# EAGLE design jarpysdr (EAGLE 6.1)
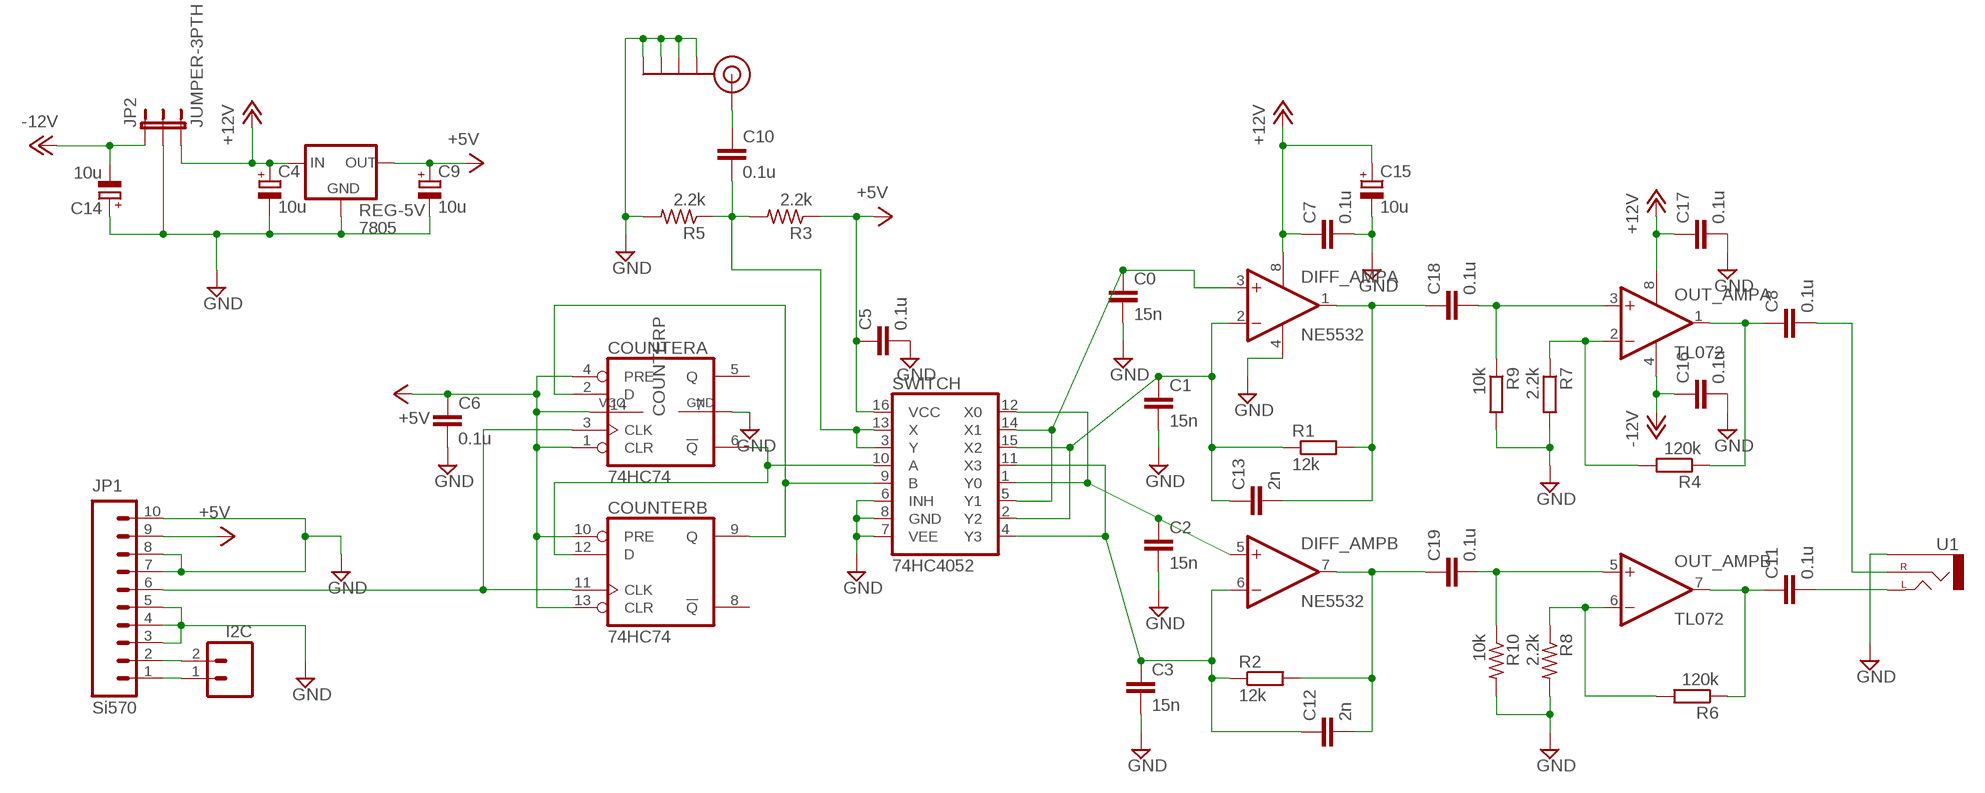
[diagram p0: schematic, sheet 1]

## Parts
ANTENNA  SMA_EDGE  [SMA-EDGE]
C0  15n  C-EU025-024X044  [C025-024X044]
C1  15n  C-EU025-024X044  [C025-024X044]
C2  15n  C-EU025-024X044  [C025-024X044]
C3  15n  C-EU025-024X044  [C025-024X044]
C4  10u  CPOL-EUE2.5-6  [E2,5-6]
C5  0.1u  C-EU025-025X050  [C025-025X050]
C6  0.1u  C-EU025-025X050  [C025-025X050]
C7  0.1u  C-EU025-025X050  [C025-025X050]
C8  0.1u  C-EU050-025X075  [C050-025X075]
C9  10u  CPOL-EUE2.5-6  [E2,5-6]
C10  0.1u  C-EU025-024X044  [C025-024X044]
C11  0.1u  C-EU050-025X075  [C050-025X075]
C12  2n  C-EU025-024X044  [C025-024X044]
C13  2n  C-EU025-024X044  [C025-024X044]
C14  10u  CPOL-EUE2.5-6  [E2,5-6]
C15  10u  CPOL-EUE2.5-6  [E2,5-6]
C16  0.1u  C-EU025-025X050  [C025-025X050]
C17  0.1u  C-EU025-025X050  [C025-025X050]
C18  0.1u  C-EU050-025X075  [C050-025X075]
C19  0.1u  C-EU050-025X075  [C050-025X075]
COUNTER  74HC74  74HC74N  [DIL14]
DIFF_AMP  NE5532  NE5532N  [DIL08]
I2C  M02PTH  [1X02]
JP1  Si570  M10"  [1X10]
JP2  JUMPER-3PTH  [1X03]
OUT_AMP  TL072  TL072P  [DIL08]
R1  12k  R-EU_0204/7  [0204/7]
R2  12k  R-EU_0204/7  [0204/7]
R3  2.2k  R-US_0204/7  [0204/7]
R4  120k  R-EU_0204/7  [0204/7]
R5  2.2k  R-US_0204/7  [0204/7]
R6  120k  R-EU_0204/7  [0204/7]
R7  2.2k  R-EU_0204/7  [0204/7]
R8  2.2k  R-US_0204/7  [0204/7]
R9  10k  R-EU_0204/7  [0204/7]
R10  10k  R-US_0204/7  [0204/7]
REG-5V  7805  78XXS  [78XXS]
SWITCH  74HC4052  74HC4052DIP  [DIL16]
U1  AUDIO-JACKPTH  [AUDIO-JACK]

## Nets
+5V: C5.1 C6.1 C9.+ COUNTER.1(A:CLR) COUNTER.4(A:PRE) COUNTER.10(B:PRE) COUNTER.13(B:CLR) COUNTER.14(P:VCC) JP1.9 R3.1 REG-5V.OUT SWITCH.16(VCC)
+12V: C4.+ C7.1 C15.+ C17.1 DIFF_AMP.8(P:V+) JP2.3 OUT_AMP.8(P:V+) REG-5V.IN
-12V: C14.- C16.1 JP2.1 OUT_AMP.4(P:V-)
C-180DEG: C1.1 C13.1 DIFF_AMP.2(A:-IN) R1.1 SWITCH.2(Y2) SWITCH.15(X2)
CLK: COUNTER.3(A:CLK) COUNTER.11(B:CLK) JP1.6
GND: ANTENNA.GND@0(GND) ANTENNA.GND@1(GND) ANTENNA.GND@2(GND) ANTENNA.GND@3(GND) C0.2 C1.2 C2.2 C3.2 C4.- C5.2 C6.2 C7.2 C9.- C14.+ C15.- C16.2 C17.2 COUNTER.7(P:GND) DIFF_AMP.4(P:V-) JP1.3 JP1.4 JP1.5 JP1.7 JP1.8 JP1.10 JP2.2 R5.2 R7.2 R8.2 R9.2 R10.2 REG-5V.GND SWITCH.6(INH) SWITCH.7(VEE) SWITCH.8(GND) U1.SLEEVE
N$1: C2.1 DIFF_AMP.5(B:+IN) SWITCH.1(Y0) SWITCH.12(X0)
N$2: COUNTER.2(A:D) COUNTER.9(B:Q) SWITCH.9(B)
N$3: COUNTER.6(A:!Q) COUNTER.12(B:D) SWITCH.10(A)
N$4: C10.2 R3.2 R5.1 SWITCH.3(Y) SWITCH.13(X)
N$5: C0.1 DIFF_AMP.3(A:+IN) SWITCH.5(Y1) SWITCH.14(X1)
N$6: C13.2 C18.1 DIFF_AMP.1(A:OUT) R1.2
N$7: ANTENNA.SIG(SIGNAL) C10.1
N$8: C11.2 U1.TIP(LEFT)
N$9: C8.2 U1.RING(RIGHT)
N$10: C12.2 C19.1 DIFF_AMP.7(B:OUT) R2.2
N$11: C8.1 OUT_AMP.1(A:OUT) R4.1
N$12: OUT_AMP.2(A:-IN) R4.2 R7.1
N$13: C11.1 OUT_AMP.7(B:OUT) R6.1
N$14: C3.1 C12.1 DIFF_AMP.6(B:-IN) R2.1 SWITCH.4(Y3) SWITCH.11(X3)
N$15: OUT_AMP.6(B:-IN) R6.2 R8.1
N$16: I2C.1 JP1.1
N$17: I2C.2 JP1.2
N$18: C18.2 OUT_AMP.3(A:+IN) R9.1
N$19: C19.2 OUT_AMP.5(B:+IN) R10.1
Unconnected: COUNTER.5(A:Q) COUNTER.8(B:!Q)

## Library data of the parts
ANTENNA = SparkFun:SMA_EDGE: SMA Antenna Connector End launch SMA connector. The paste layer has been removed so that the connector can be hand soldered onto the board after reflow.
C0 C1-C3 C5-C8 C10-C13 C16-C19 = resistor:C-EU: CAPACITOR, European symbol
C4 C9 C14 C15 = resistor:CPOL-EU: POLARIZED CAPACITOR, European symbol
COUNTER = jarpy:74*74: Dual D type positive edge triggered FLIP FLOP, preset and clear
DIFF_AMP = linear:NE5532: AUDIO AMPLIFIER
I2C = SparkFun:M02: Header 2 Standard 2-pin 0.1" header. Use with straight break away headers (SKU : PRT-00116), right angle break away headers (PRT-00553), swiss pins (PRT-00743), machine pins (PRT-00117), and female headers (PRT-00115). Molex polarized connector foot print use with SKU : PRT-08233 with associated crimp pins and housings.
JP1 = SparkFun:M10: Header 10 Standard 10-pin 0.1" header. Use with straight break away headers (SKU : PRT-00116), right angle break away headers (PRT-00553), swiss pins (PRT-00743), machine pins (PRT-00117), and female headers (PRT-00115).
JP2 = SparkFun:JUMPER-3
OUT_AMP = linear:TL072: OP AMP
R1 R2 R4 R6 R7 R9 = resistor:R-EU_: RESISTOR, European symbol
R3 R5 R8 R10 = resistor:R-US_: RESISTOR, American symbol
REG-5V = v-reg:78XXS: VOLTAGE REGULATOR
SWITCH = SparkFun:74HC4052
U1 = SparkFun:AUDIO-JACK: 3.5mm Audio Jack Simple 3.5mm common PCB mount audio jack. SKU: PRT-08032

## Board
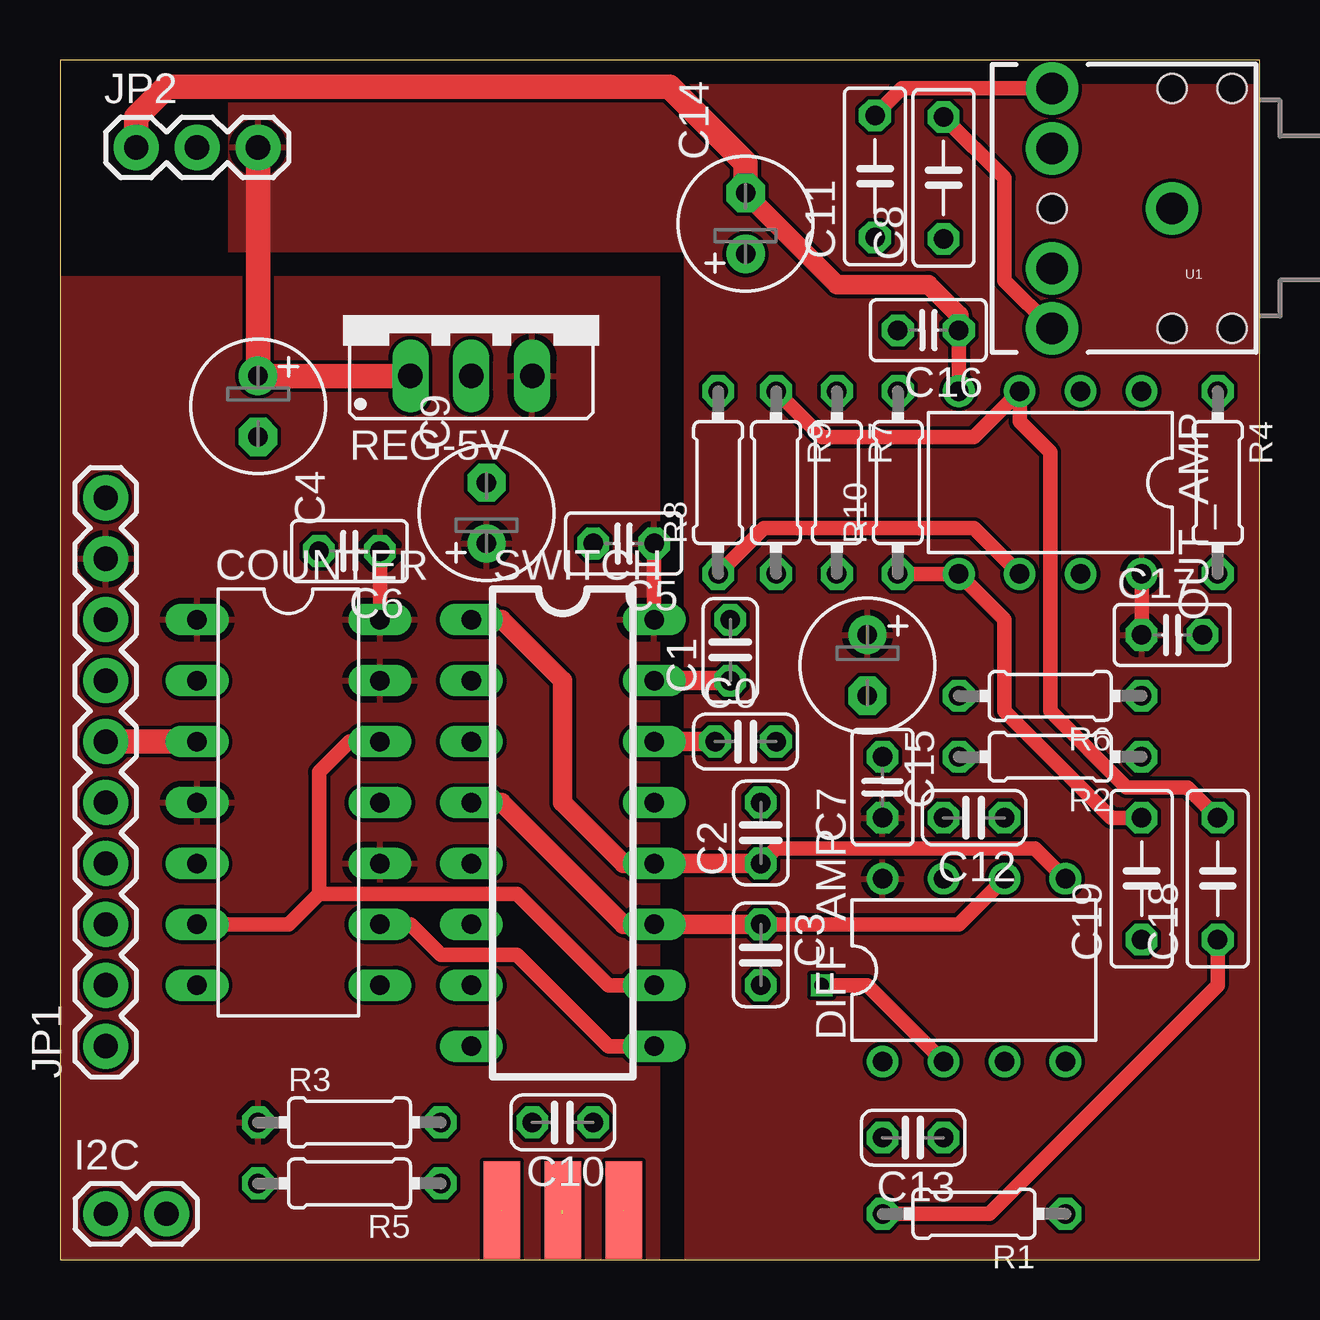
[diagram p1: board, top side]
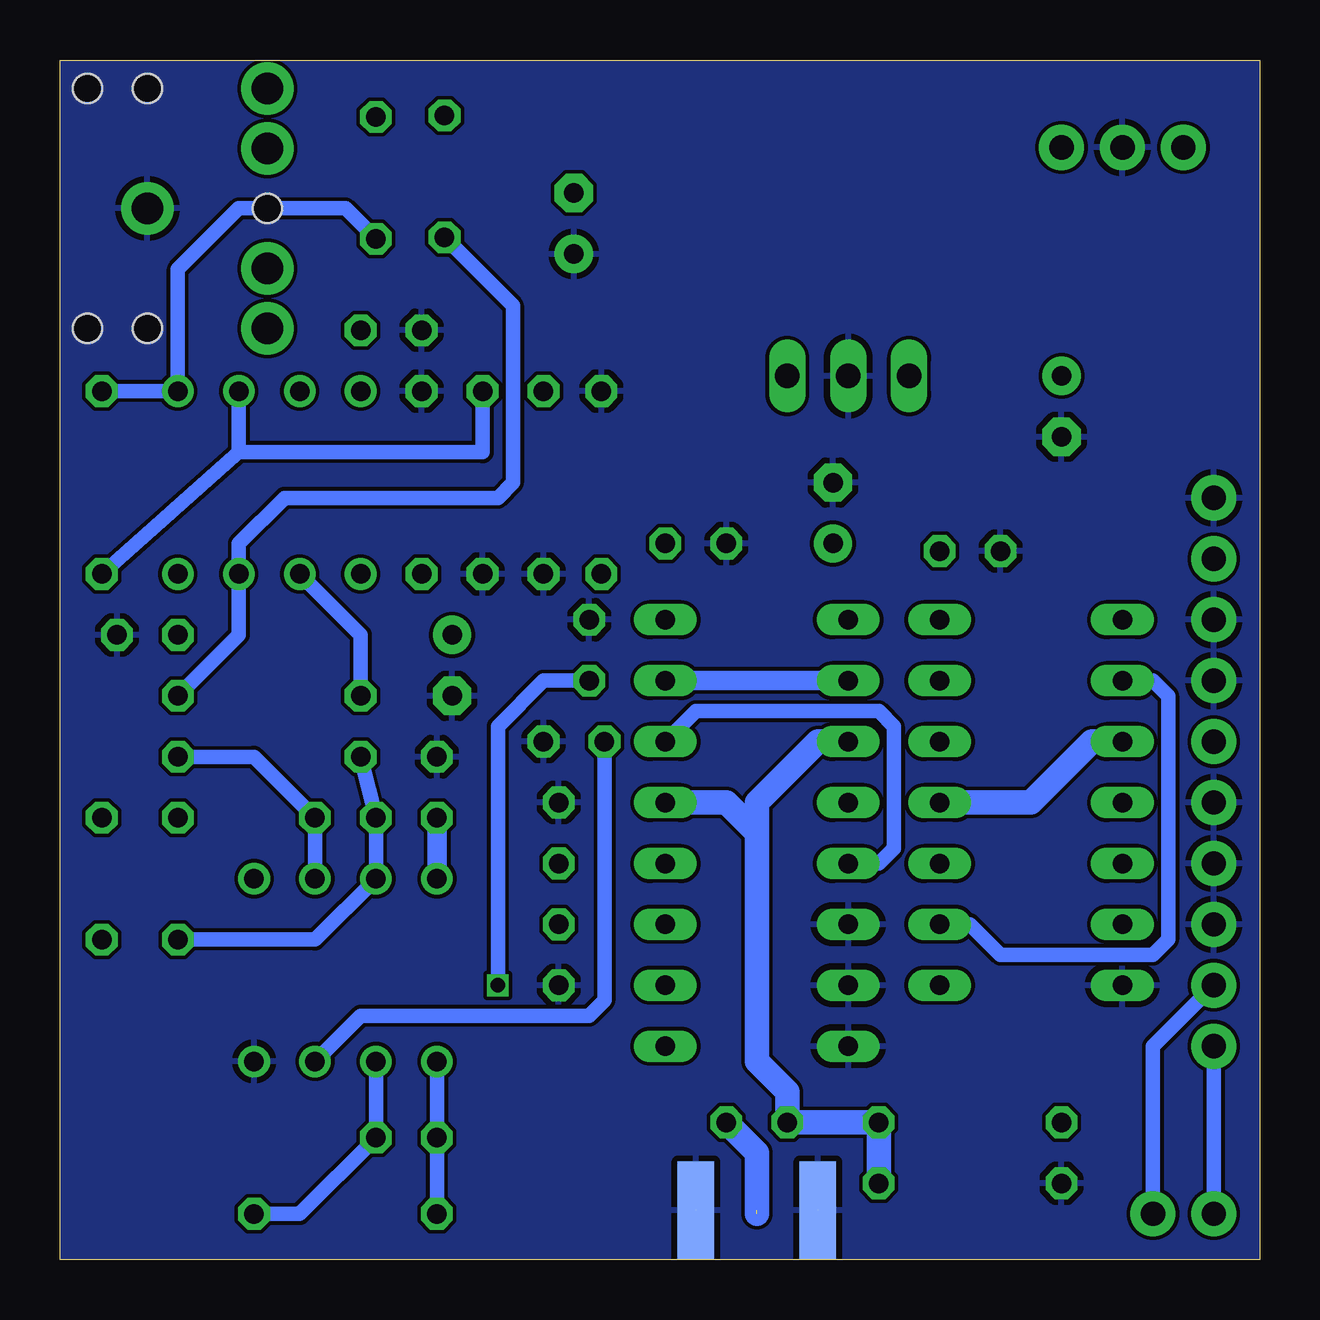
[diagram p2: board, bottom side, seen from below]

Size 50 x 50 mm. Coordinates in mm from the lower left corner, seen from the top.
Outline: 0,0 50,0 50,50 0,50 0,0
Copper layers (1*16): Top 0.035mm / dielectric 1.5mm / Bottom 0.035mm
Design rules: minimum track width 6mil, minimum drill 12mil, track to track 6mil, track to pad 6mil, pad to pad 6mil, via to via 6mil, smd to smd 0mil, copper to edge 0mil, drill to drill 10mil, minimum pad ring 10mil, minimum via ring 6mil, stop-mask expansion 2mil, vias tented up to drill 100mil, thermal gap 10mil

### Footprints (pad centres in the part's own frame; a part is rotated, then mirrored left to right if it is on the bottom)
SMA-EDGE = smd 1.524 x 4.064: GND@0 0,0; GND@1 5.08,0; SIG 2.54,0 | smd 1.524 x 4.064 bottom: GND@2 0,0; GND@3 5.08,0
C025-024X044 = drill 0.813 octagon: 1 -1.27,0; 2 1.27,0
E2,5-6 = drill 0.813 pad 1.6: + -1.27,0 | drill 0.813 pad 1.6 octagon: - 1.27,0
C025-025X050 = drill 0.813 octagon: 1 -1.27,0; 2 1.27,0
C050-025X075 = drill 0.813 octagon: 1 -2.54,0; 2 2.54,0
DIL14 = drill 0.813 long: 1 -7.62,-3.81; 2 -5.08,-3.81; 3 -2.54,-3.81; 4 0,-3.81; 5 2.54,-3.81; 6 5.08,-3.81; 7 7.62,-3.81; 8 7.62,3.81; 9 5.08,3.81; 10 2.54,3.81; 11 0,3.81; 12 -2.54,3.81; 13 -5.08,3.81; 14 -7.62,3.81
DIL08 = drill 0.813 pad 1.27: 1 -3.81,-3.81; 2 -1.27,-3.81; 3 1.27,-3.81; 4 3.81,-3.81; 5 3.81,3.81; 6 1.27,3.81; 7 -1.27,3.81; 8 -3.81,3.81
1X02 = drill 1.016 pad 1.88: 1 0,0; 2 2.54,0
1X10 = drill 1.016 pad 1.88: 1 0,0; 2 2.54,0; 3 5.08,0; 4 7.62,0; 5 10.16,0; 6 12.7,0; 7 15.24,0; 8 17.78,0; 9 20.32,0; 10 22.86,0
1X03 = drill 1.016 pad 1.88: 1 0,0; 2 2.54,0; 3 5.08,0
0204/7 = drill 0.813 octagon: 1 -3.81,0; 2 3.81,0
78XXS = drill 1.016 long: GND 0,-2.54; IN -2.54,-2.54; OUT 2.54,-2.54
DIL16 = drill 0.813 long: 1 -8.89,-3.81; 2 -6.35,-3.81; 3 -3.81,-3.81; 4 -1.27,-3.81; 5 1.27,-3.81; 6 3.81,-3.81; 7 6.35,-3.81; 8 8.89,-3.81; 9 8.89,3.81; 10 6.35,3.81; 11 3.81,3.81; 12 1.27,3.81; 13 -1.27,3.81; 14 -3.81,3.81; 15 -6.35,3.81; 16 -8.89,3.81
AUDIO-JACK = drill 1.3 pad 2.184: RING 5,5; RSH 5,2.5; SLEEVE 0,0; TIP 5,-5; TSH 5,-2.5 | hole 1.2: 0,5; -2.5,5; -2.5,-5; 0,-5; 5,0

### Placement (x,y rotation side)
ANTENNA  23.5,2.06 180 top
C0  28.57,21.59 0 top
C1  27.94,25.4 90 top
C2  29.21,17.78 90 top
C3  29.21,12.7 270 top
C4  8.26,35.56 270 top
C5  23.5,29.84 180 top
C6  12.06,29.53 180 top
C7  34.29,19.68 90 top
C8  36.83,45.09 90 top
C9  17.78,31.11 90 top
C10  20.95,5.71 180 top
C11  33.97,45.15 90 top
C12  38.1,18.41 180 top
C13  35.56,5.08 180 top
C14  28.57,43.18 90 top
C15  33.66,24.77 270 top
C16  36.2,38.73 180 top
C17  46.35,26.04 0 top
C18  48.26,15.88 90 top
C19  45.09,15.88 90 top
COUNTER  9.53,19.05 270 top
DIFF_AMP  38.1,12.06 0 top
I2C  1.91,1.91 0 top
JP1  1.91,8.89 90 top
JP2  3.17,46.35 0 top
OUT_AMP  41.27,32.38 180 top
R1  38.1,1.91 180 top
R2  41.27,20.95 180 top
R3  12.06,5.71 0 top
R4  48.26,32.38 270 top
R5  12.06,3.17 180 top
R6  41.27,23.5 180 top
R7  32.38,32.38 270 top
R8  27.43,32.38 90 top
R9  29.84,32.38 270 top
R10  34.92,32.38 90 top
REG-5V  17.14,39.37 0 top
SWITCH  20.95,17.78 270 top
U1  46.35,43.81 180 top

### Tracks (layer width: path | path; a pad name or v marks a point on that pad's centre or on a via)
+5V
  Top 0.61: C6.1 COUNTER.14 | C5.1 SWITCH.16
  pour Top: 0,0 25,0 25,41 0,41
+12V
  Top 0.61: OUT_AMP.8 C17.1
  Top 1.016: JP2.3 C4.+ REG-5V.IN
  Bottom 0.813: C7.1 DIFF_AMP.8
  pour Top: 7,42 7,49 50,49 50,0 26.04,0 26,42
-12V
  Top 0.61: C16.1 OUT_AMP.4
  Top 0.813: C14.- 32.38,40.64 36.2,40.64 37.47,39.37 C16.1
  Top 1.016: JP2.1 3.17,47.62 4.45,48.9 25.4,48.9 28.57,45.72 C14.-
C-180DEG  (via drill 0.6)
  Top 0.61: DIFF_AMP.2 33.66,11.43 v31.75,11.43
  Top 0.813: SWITCH.15 C1.1
  Bottom 0.61: DIFF_AMP.2 C13.1 40.01,1.91 R1.1 | v31.75,11.43 31.75,22.23 29.84,24.13 C1.1
  Bottom 0.813: SWITCH.2 SWITCH.15
CLK
  Top 1.016: COUNTER.3 JP1.6
  Bottom 1.016: COUNTER.3 6.99,21.59 9.53,19.05 COUNTER.11
GND  (2 unrouted)
  pour Bottom: 0,50 50,50 50,0 0,0
N$1
  Top 0.61: DIFF_AMP.5 40.64,17.14 29.84,17.14 C2.1
  Top 0.813: C2.1 SWITCH.12 23.5,16.51 20.95,19.05 20.95,24.13 18.41,26.67 SWITCH.1
N$2
  Top 0.61: COUNTER.9 14.61,13.97 15.88,12.7 19.05,12.7 22.86,8.89 SWITCH.9
  Bottom 0.61: COUNTER.2 4.45,24.13 3.81,23.5 3.81,13.34 4.45,12.7 10.79,12.7 12.06,13.97 COUNTER.9
N$3
  Top 0.61: COUNTER.12 12.06,21.59 10.79,20.32 10.79,15.24 | 10.79,15.24 9.53,13.97 COUNTER.6 | SWITCH.10 22.86,11.43 19.05,15.24 10.79,15.24
N$4
  Bottom 1.016: 20.95,17.78 20.95,8.26 19.68,6.99 C10.2 R3.2 R5.1 | 20.95,17.78 22.23,19.05 SWITCH.13 | SWITCH.3 18.41,21.59 20.95,19.05 20.95,17.78
N$5
  Top 0.813: SWITCH.14 C0.1
  Bottom 0.61: C0.1 27.3,10.79 27.94,10.16 37.47,10.16 DIFF_AMP.3 | SWITCH.14 23.5,22.86 15.88,22.86 15.24,22.23 15.24,17.14 15.88,16.51 SWITCH.5
N$6
  Top 0.61: C18.1 48.26,11.43 38.73,1.91 R1.2
  Bottom 0.61: DIFF_AMP.1 C13.2 R1.2
N$7  (1 unrouted)
  Bottom 1.016: C10.1 20.95,4.45 20.95,1.91
N$8
  Top 0.61: U1.TIP 35.1,48.81 C11.2
N$9
  Top 0.61: U1.RING 39.37,40.8 39.37,45.09 C8.2
N$10
  Bottom 0.61: R2.2 C12.2 DIFF_AMP.7 39.37,13.34 C19.1
N$11
  Bottom 0.61: C8.1 38.1,43.81 42.55,43.81 45.09,41.27 OUT_AMP.1 R4.1
N$12
  Bottom 0.61: OUT_AMP.2 42.55,33.66 | 42.55,33.66 R4.2 | R7.1 32.38,33.66 42.55,33.66
N$13
  Bottom 0.61: C11.1 31.11,39.75 31.11,32.38 31.75,31.75 40.64,31.75 42.55,29.84 OUT_AMP.7 42.55,26.04 R6.1
N$14
  Top 0.61: DIFF_AMP.6 37.47,13.97 C3.1
  Top 0.813: C3.1 SWITCH.11 23.5,13.97 18.41,19.05 SWITCH.4
  Bottom 0.61: DIFF_AMP.6 C12.1 41.91,20.95 R2.1
N$15
  Top 0.61: R8.1 29.34,30.48 38.1,30.48 OUT_AMP.6
  Bottom 0.61: OUT_AMP.6 37.47,26.04 R6.2
N$16
  Bottom 0.61: JP1.1 I2C.1
N$17
  Bottom 0.61: JP1.2 4.45,8.89 I2C.2
N$18
  Top 0.61: R9.1 31.75,34.29 38.1,34.29 OUT_AMP.3 40.01,34.92 41.27,33.66 41.27,22.86 44.45,19.68 46.99,19.68 C18.2
N$19
  Top 0.61: R10.1 OUT_AMP.5 39.37,26.67 39.37,22.86 43.81,18.41 C19.2